# Altium schematic sheet 13.RK3568_FlashSD Controller.SchDoc
size 420 x 297 mm
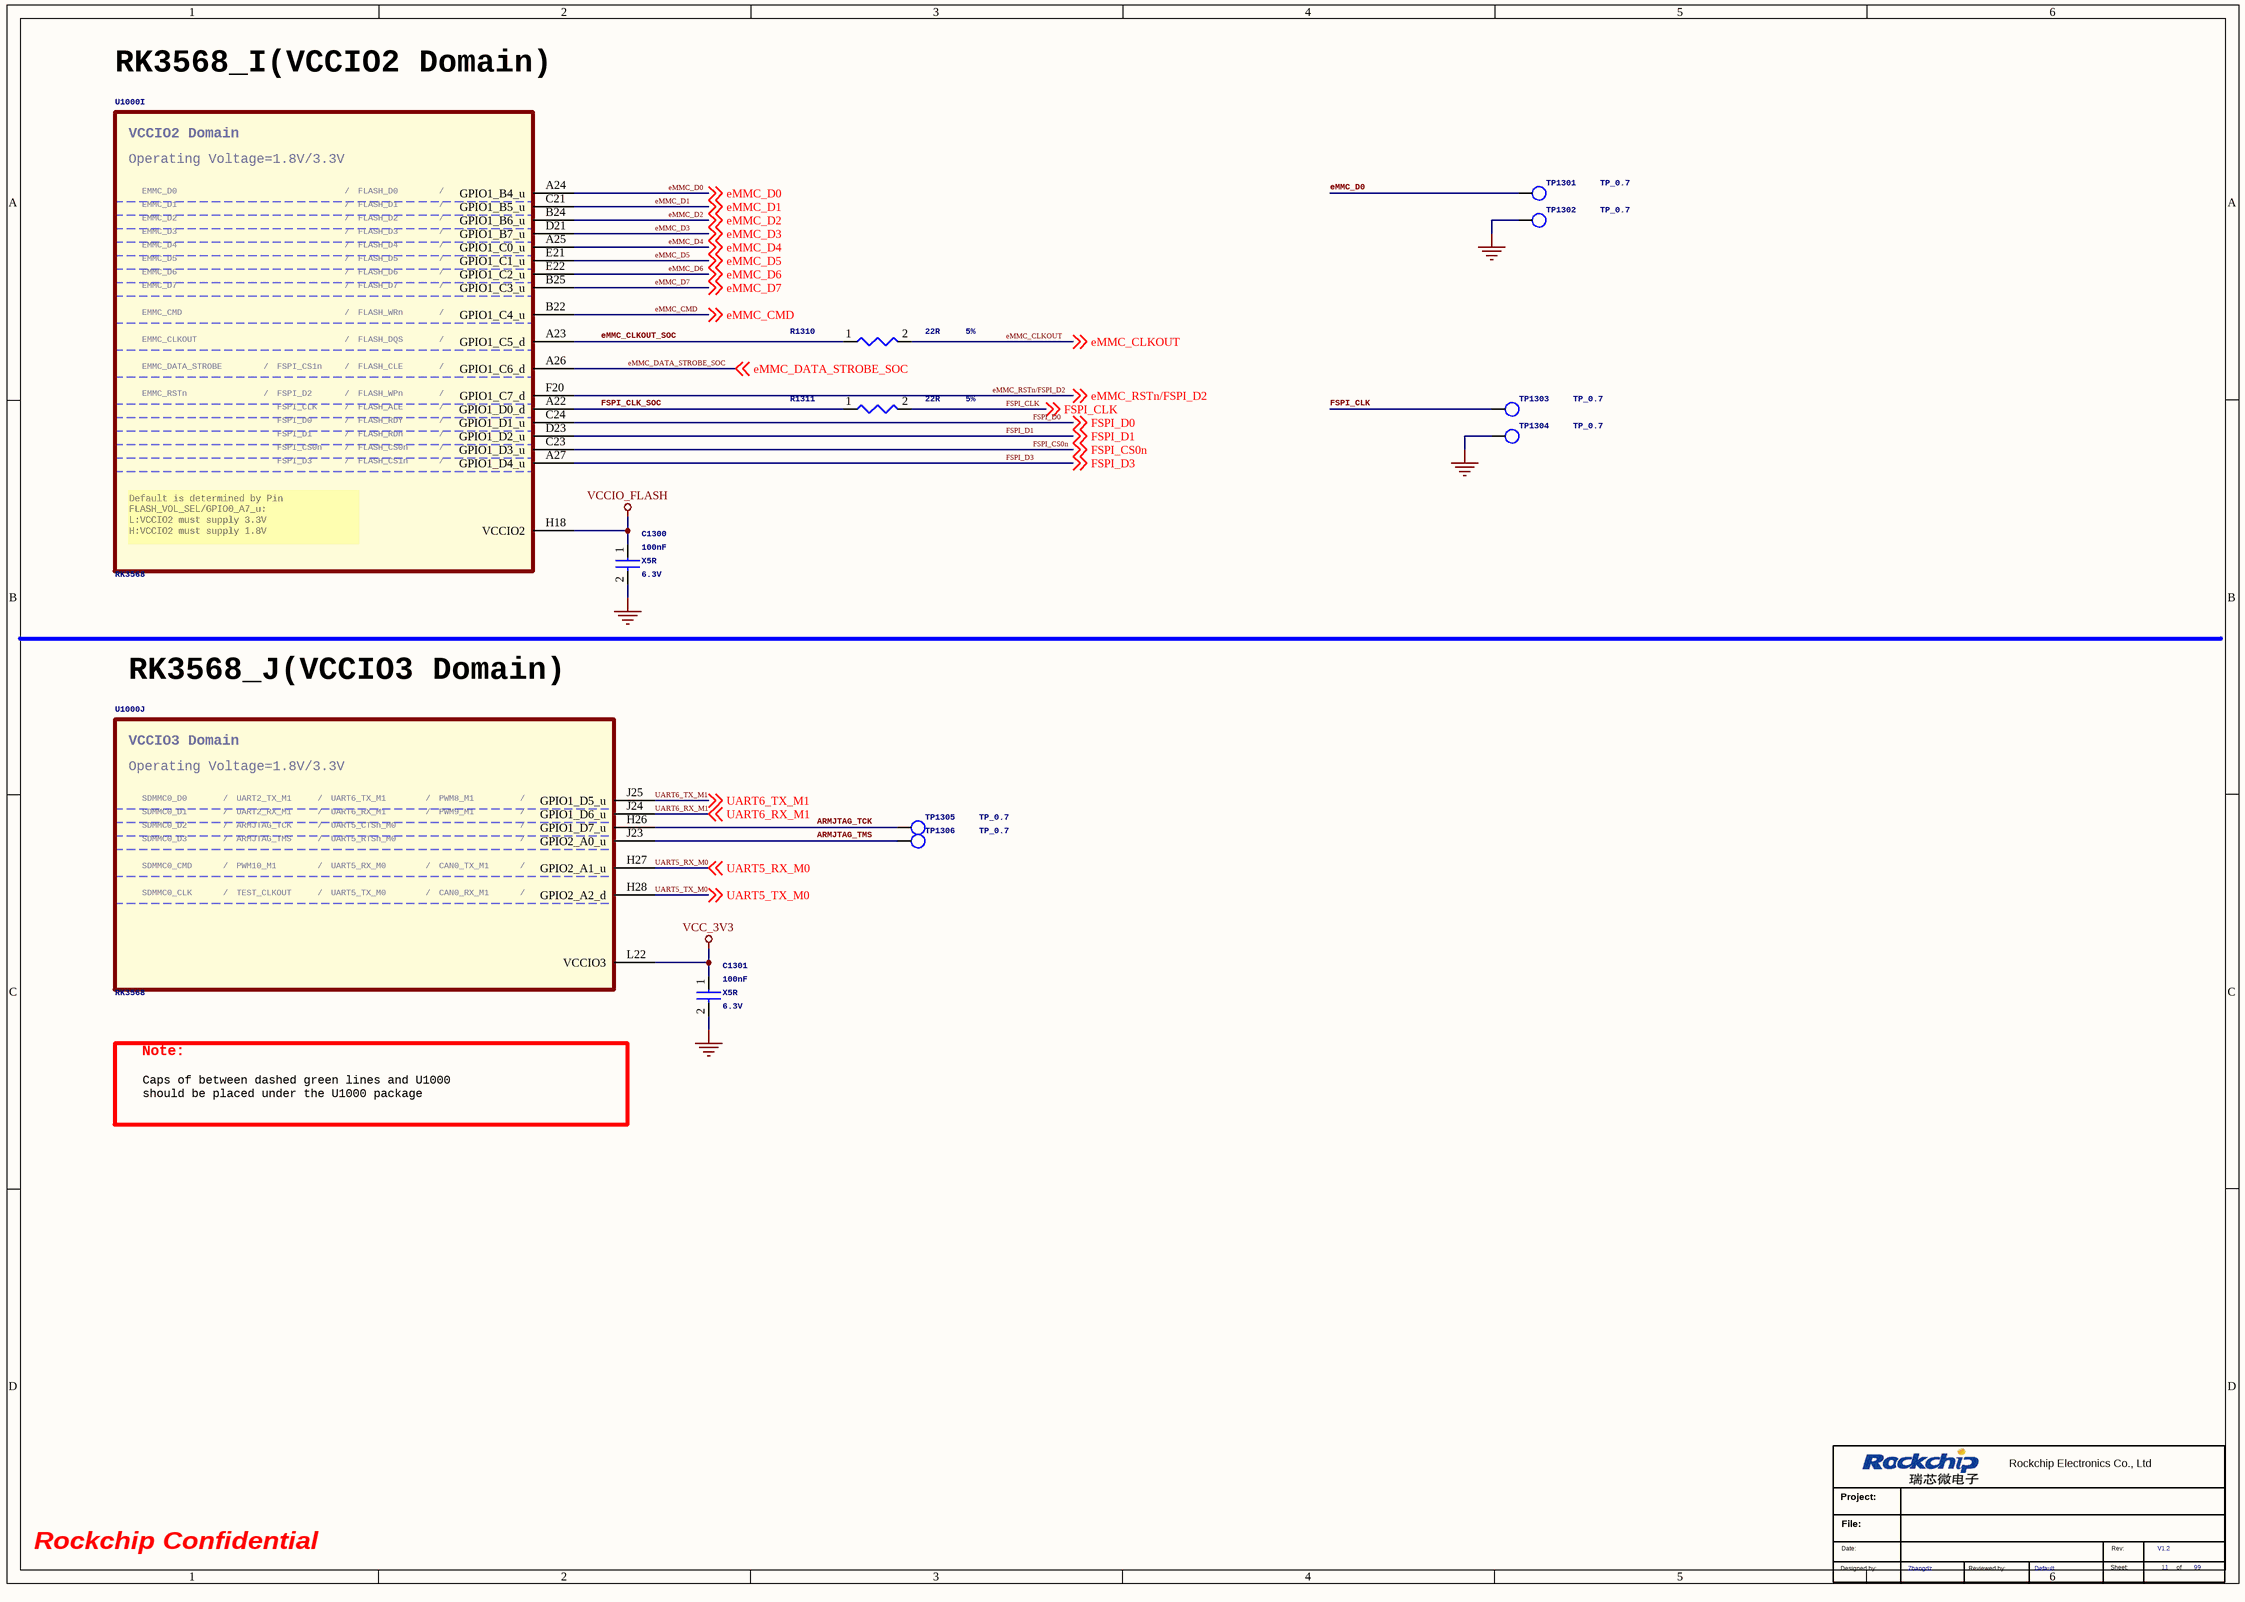
[diagram p0: 13.RK3568_FlashSD Controller.SchDoc]

## Parts
*  Schematic Page Count: 99  Schematic Page Number: 11  Designer: Zhangdz  Revision: V1.2  Check: Default  (hidden comment: Rockchip_new)  (graphical)
C1300  100nF  Voltage: 6.3V  Dielectric: X5R  [C0201]
C1301  100nF  Voltage: 6.3V  Dielectric: X5R  [C0201]
R1310  22R  Tolerance: 5%  [R0402]
R1311  22R  Tolerance: 5%  [R0402]
TP1301  TP_0.7  [TP_0R70]
TP1302  TP_0.7  [TP_0R70]
TP1303  TP_0.7  [TP_0R70]
TP1304  TP_0.7  [TP_0R70]
TP1305  TP_0.7  [TP_0R70]
TP1306  TP_0.7  [TP_0R70]
U1000  RK3568  [BGA636_19R00X19R00X1R20]  (parts I,J of 23)

## Nets
GND: C1300.2 C1301.2 TP1302.1 TP1304.1
VCC_3V3: C1301.1 U1000.L22(VCCIO3)
VCCIO_FLASH: C1300.1 U1000.H18(VCCIO2)
ARMJTAG_TCK: TP1305.1 U1000.H26(GPIO1_D7_u)
ARMJTAG_TMS: TP1306.1 U1000.J23(GPIO2_A0_u)
eMMC_CLKOUT: R1310.2 ; off-sheet eMMC_CLKOUT
eMMC_CLKOUT_SOC: R1310.1 U1000.A23(GPIO1_C5_d)
eMMC_CMD: U1000.B22(GPIO1_C4_u) ; off-sheet eMMC_CMD
eMMC_D0: TP1301.1 U1000.A24(GPIO1_B4_u) ; off-sheet eMMC_D0
eMMC_D1: U1000.C21(GPIO1_B5_u) ; off-sheet eMMC_D1
eMMC_D2: U1000.B24(GPIO1_B6_u) ; off-sheet eMMC_D2
eMMC_D3: U1000.D21(GPIO1_B7_u) ; off-sheet eMMC_D3
eMMC_D4: U1000.A25(GPIO1_C0_u) ; off-sheet eMMC_D4
eMMC_D5: U1000.E21(GPIO1_C1_u) ; off-sheet eMMC_D5
eMMC_D6: U1000.E22(GPIO1_C2_u) ; off-sheet eMMC_D6
eMMC_D7: U1000.B25(GPIO1_C3_u) ; off-sheet eMMC_D7
eMMC_DATA_STROBE_SOC: U1000.A26(GPIO1_C6_d) ; off-sheet eMMC_DATA_STROBE_SOC
eMMC_RSTn/FSPI_D2: U1000.F20(GPIO1_C7_d) ; off-sheet eMMC_RSTn/FSPI_D2
FSPI_CLK: R1311.2 TP1303.1 ; off-sheet FSPI_CLK
FSPI_CLK_SOC: R1311.1 U1000.A22(GPIO1_D0_d)
FSPI_CS0n: U1000.C23(GPIO1_D3_u) ; off-sheet FSPI_CS0n
FSPI_D0: U1000.C24(GPIO1_D1_u) ; off-sheet FSPI_D0
FSPI_D1: U1000.D23(GPIO1_D2_u) ; off-sheet FSPI_D1
FSPI_D3: U1000.A27(GPIO1_D4_u) ; off-sheet FSPI_D3
UART5_RX_M0: U1000.H27(GPIO2_A1_u) ; off-sheet UART5_RX_M0
UART5_TX_M0: U1000.H28(GPIO2_A2_d) ; off-sheet UART5_TX_M0
UART6_RX_M1: U1000.J24(GPIO1_D6_u) ; off-sheet UART6_RX_M1
UART6_TX_M1: U1000.J25(GPIO1_D5_u) ; off-sheet UART6_TX_M1

## Notes on the sheet
- RK3568_I(VCCIO2 Domain)
- RK3568_J(VCCIO3 Domain)
- Note:
- Caps of between dashed green lines and U1000
  should be placed under the U1000 package
- Rockchip Confidential
- (in symbol Rockchip_new) Rockchip Electronics Co., Ltd; Project:; File:; Date:; Rev:; Sheet:; of; Designed by:; Reviewed by:
- (in symbol SOC_RK3568, part I) VCCIO2 Domain; Operating Voltage=1.8V/3.3V; EMMC_D0; /; FLASH_D0; EMMC_D1; FLASH_D1; EMMC_D2; FLASH_D2; EMMC_D3; FLASH_D3; EMMC_D4; FLASH_D4; EMMC_D5; FLASH_D5; EMMC_D6; FLASH_D6; EMMC_D7; FLASH_D7; EMMC_CMD; FLASH_WRn; EMMC_CLKOUT; FLASH_DQS; EMMC_DATA_STROBE; FSPI_CS1n; FLASH_CLE; EMMC_RSTn; FSPI_D2; FLASH_WPn; FSPI_CLK; FLASH_ALE; FSPI_D0; FLASH_RDY; FSPI_D1; FLASH_RDn; FSPI_CS0n; FLASH_CS0n; FSPI_D3; FLASH_CS1n; Default is determined by Pin / FLASH_VOL_SEL/GPIO0_A7_u: / L:VCCIO2 must supply 3.3V / H:VCCIO2 must supply 1.8V
- (in symbol SOC_RK3568, part J) VCCIO3 Domain; Operating Voltage=1.8V/3.3V; SDMMC0_D0; /; UART2_TX_M1; UART6_TX_M1; PWM8_M1; SDMMC0_D1; UART2_RX_M1; UART6_RX_M1; PWM9_M1; SDMMC0_D2; ARMJTAG_TCK; UART5_CTSn_M0; SDMMC0_D3; ARMJTAG_TMS; UART5_RTSn_M0; SDMMC0_CMD; PWM10_M1; UART5_RX_M0; CAN0_TX_M1; SDMMC0_CLK; TEST_CLKOUT; UART5_TX_M0; CAN0_RX_M1

## Library data of the parts
* = Rockchip_new: Page Count: 37; Page Number: 10; Revcode: V1.2
C1300 = CAP NP: cap,100.00nF,+/-10%,6.3V,X5R,C0201; Manufacturer PN: C0603X5R0J104K030BC; Manufacturer: TDK; Tolerance: 10%; Priority: A; Created by: JJJ; Part Type: C0201; RK PN: C0603X5R0J104K030BC
C1301 = CAP NP: cap,100.00nF,+/-10%,6.3V,X5R,C0201; Manufacturer: TDK; RK PN: C0603X5R0J104K030BC; Priority: A; Tolerance: 10%; Part Type: C0201; Manufacturer PN: C0603X5R0J104K030BC; Created by: JJJ
R1310 = RESISTOR: 通用厚膜电阻,22R,+/-5%,R0402,1/16W.; Manufacturer PN: RC0402JR-0722RL; Manufacturer: YAGEO; Wattage: 1/16W; Priority: A; Created by: YTL; Part Type: 通用厚膜电阻; RK PN: RC0402JR-0722RL
R1311 = RESISTOR: 通用厚膜电阻,22R,+/-5%,R0402,1/16W.; Manufacturer: YAGEO; RK PN: RC0402JR-0722RL; Priority: A; Wattage: 1/16W; Part Type: 通用厚膜电阻; Manufacturer PN: RC0402JR-0722RL; Created by: YTL
TP1301 TP1304 TP1306 = TP: Test Point 0.7mm; RK PN: TESTPOINT_0R7; Priority: A; Part Type: TP; Created by: JJJ
TP1302 TP1303 TP1305 = TP: Test Point 0.7mm; Priority: A; RK PN: TESTPOINT_0R7; Created by: JJJ; Part Type: TP
U1000 = SOC_RK3568: ROCKCHIP SOC; Manufacturer: Rockchip (瑞芯微); SPLIT_INST: TRUE; SWAP_INFO: (S1+S2+S3+S4+S5+S6+S7+S8+S9+S10+S11+S12+S13+S14+S15+S16+S17+S18+S19+S20+S21+S22+S23); Priority: A; Created by: JJJ; Manufacturer PN: RK3568; Part Type: SOC; RK PN: RK3568